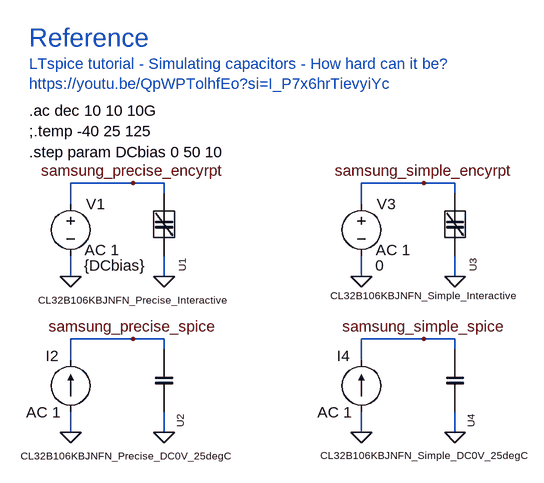
[diagram p0: schematic 07-CL32B106KBJNFN_impedance.asc]
07-CL32B106KBJNFN_impedance.asc, the LTspice schematic file:
Version 4
SHEET 1 1452 1420
WIRE 128 304 32 304
WIRE 176 304 128 304
WIRE 576 304 480 304
WIRE 624 304 576 304
WIRE 176 320 176 304
WIRE 624 320 624 304
WIRE 32 336 32 304
WIRE 480 336 480 304
WIRE 32 448 32 416
WIRE 176 448 176 416
WIRE 480 448 480 416
WIRE 624 448 624 416
WIRE 128 544 32 544
WIRE 176 544 128 544
WIRE 576 544 480 544
WIRE 624 544 576 544
WIRE 176 560 176 544
WIRE 624 560 624 544
WIRE 32 576 32 544
WIRE 480 576 480 544
WIRE 32 688 32 656
WIRE 176 688 176 656
WIRE 480 688 480 656
WIRE 624 688 624 656
FLAG 32 448 0
FLAG 176 448 0
FLAG 128 304 samsung_precise_encyrpt
FLAG 32 688 0
FLAG 176 688 0
FLAG 128 544 samsung_precise_spice
FLAG 480 448 0
FLAG 624 448 0
FLAG 576 304 samsung_simple_encyrpt
FLAG 480 688 0
FLAG 624 688 0
FLAG 576 544 samsung_simple_spice
SYMBOL CL32B106KBJNFN_Precise_Interactive_LT 176 368 R90
WINDOW 38 116 52 VCenter 1
SYMATTR InstName U1
SYMBOL current 32 656 R180
WINDOW 0 18 86 Left 2
WINDOW 3 24 0 Left 2
WINDOW 123 15 -1 Left 2
WINDOW 39 0 0 Left 0
SYMATTR InstName I2
SYMATTR Value ""
SYMATTR Value2 AC 1
SYMBOL CL32B106KBJNFN_Precise_DC0V_25degC_LT 176 608 R90
WINDOW 38 116 62 VCenter 1
SYMATTR InstName U2
SYMBOL current 480 656 R180
WINDOW 0 18 86 Left 2
WINDOW 3 24 0 Left 2
WINDOW 123 15 -1 Left 2
WINDOW 39 0 0 Left 0
SYMATTR InstName I4
SYMATTR Value ""
SYMATTR Value2 AC 1
SYMBOL CL32B106KBJNFN_Simple_Interactive_LT 624 368 R90
WINDOW 38 109 52 VCenter 1
SYMATTR InstName U3
SYMBOL CL32B106KBJNFN_Simple_DC0V_25degC_LT 624 608 R90
WINDOW 38 115 51 VCenter 1
SYMATTR InstName U4
SYMBOL voltage 480 320 R0
WINDOW 3 21 111 Left 2
WINDOW 123 22 87 Left 2
WINDOW 39 0 0 Left 0
SYMATTR InstName V3
SYMATTR Value 0
SYMATTR Value2 AC 1
SYMBOL voltage 32 320 R0
WINDOW 3 21 111 Left 2
WINDOW 123 22 87 Left 2
WINDOW 39 0 0 Left 0
SYMATTR InstName V1
SYMATTR Value {DCbias}
SYMATTR Value2 AC 1
TEXT -32 192 Left 2 !.ac dec 10 10 10G
TEXT -32 120 Left 2 ;LTspice tutorial - Simulating capacitors - How hard can it be?\nhttps://youtu.be/QpWPTolhfEo?si=I_P7x6hrTievyiYc
TEXT -32 80 Left 4 ;Reference
TEXT -32 224 Left 2 !;.temp -40 25 125
TEXT -32 256 Left 2 !.step param DCbias 0 50 10

The netlist it stands for:
* 07-CL32B106KBJNFN_impedance.asc
XU1 0 samsung_precise_encyrpt CL32B106KBJNFN_Precise_Interactive  ; pins A B
I2 0 samsung_precise_spice AC 1
XU2 0 samsung_precise_spice CL32B106KBJNFN_Precise_DC0V_25degC  ; pins A B
I4 0 samsung_simple_spice AC 1
XU3 0 samsung_simple_encyrpt CL32B106KBJNFN_Simple_Interactive  ; pins A B
XU4 0 samsung_simple_spice CL32B106KBJNFN_Simple_DC0V_25degC  ; pins A B
V3 samsung_simple_encyrpt 0 0 AC 1
V1 samsung_precise_encyrpt 0 {DCbias} AC 1
.ac dec 10 10 10G
* LTspice tutorial - Simulating capacitors - How hard can it be?
* https://youtu.be/QpWPTolhfEo?si=I_P7x6hrTievyiYc
* Reference
;.temp -40 25 125
.step param DCbias 0 50 10
.lib CL32B106KBJNFN_Precise_Interactive_LT.mod
.lib CL32B106KBJNFN_Precise_DC0V_25degC_LT.mod
.lib CL32B106KBJNFN_Simple_Interactive_LT.mod
.lib CL32B106KBJNFN_Simple_DC0V_25degC_LT.mod
.backanno
.end

* Results of the author's LTspice run, read from the files saved beside the schematic
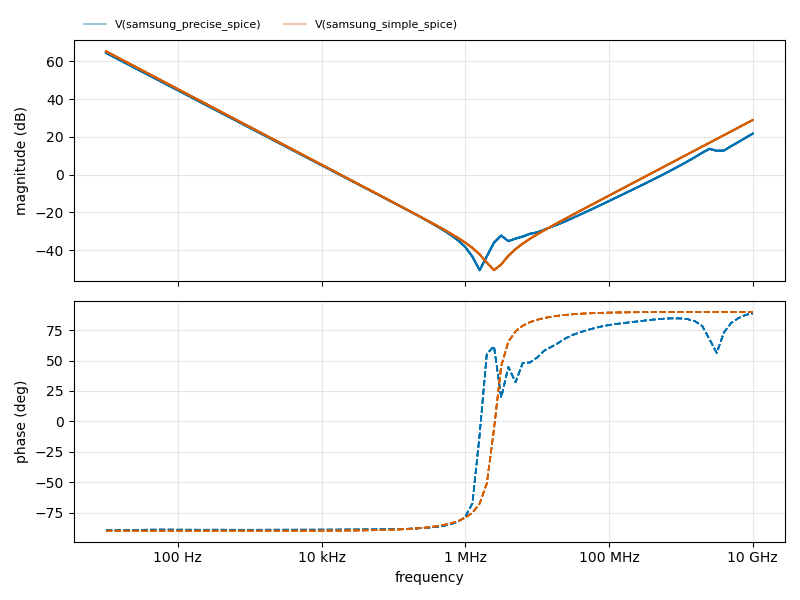
[diagram p1: AC Analysis of 07-CL32B106KBJNFN_impedance.asc, plotted from the saved traces]
* AC Analysis, 6 runs:
*   V(samsung_precise_spice) [dcbias=0]: 64.50 dB at 10 Hz, 21.73 dB at 10 GHz, peak 64.50 dB at 10 Hz, 3 dB below the peak at 14.16 Hz
*   V(samsung_precise_spice) [dcbias=10]: 64.50 dB at 10 Hz, 21.73 dB at 10 GHz, peak 64.50 dB at 10 Hz, 3 dB below the peak at 14.16 Hz
*   V(samsung_precise_spice) [dcbias=20]: 64.50 dB at 10 Hz, 21.73 dB at 10 GHz, peak 64.50 dB at 10 Hz, 3 dB below the peak at 14.16 Hz
*   V(samsung_precise_spice) [dcbias=30]: 64.50 dB at 10 Hz, 21.73 dB at 10 GHz, peak 64.50 dB at 10 Hz, 3 dB below the peak at 14.16 Hz
*   V(samsung_precise_spice) [dcbias=40]: 64.50 dB at 10 Hz, 21.73 dB at 10 GHz, peak 64.50 dB at 10 Hz, 3 dB below the peak at 14.16 Hz
*   V(samsung_precise_spice) [dcbias=50]: 64.50 dB at 10 Hz, 21.73 dB at 10 GHz, peak 64.50 dB at 10 Hz, 3 dB below the peak at 14.16 Hz
*   V(samsung_simple_spice) [dcbias=0]: 65.33 dB at 10 Hz, 28.93 dB at 10 GHz, peak 65.33 dB at 10 Hz, 3 dB below the peak at 14.14 Hz
*   V(samsung_simple_spice) [dcbias=10]: 65.33 dB at 10 Hz, 28.93 dB at 10 GHz, peak 65.33 dB at 10 Hz, 3 dB below the peak at 14.14 Hz
*   V(samsung_simple_spice) [dcbias=20]: 65.33 dB at 10 Hz, 28.93 dB at 10 GHz, peak 65.33 dB at 10 Hz, 3 dB below the peak at 14.14 Hz
*   V(samsung_simple_spice) [dcbias=30]: 65.33 dB at 10 Hz, 28.93 dB at 10 GHz, peak 65.33 dB at 10 Hz, 3 dB below the peak at 14.14 Hz
*   V(samsung_simple_spice) [dcbias=40]: 65.33 dB at 10 Hz, 28.93 dB at 10 GHz, peak 65.33 dB at 10 Hz, 3 dB below the peak at 14.14 Hz
*   V(samsung_simple_spice) [dcbias=50]: 65.33 dB at 10 Hz, 28.93 dB at 10 GHz, peak 65.33 dB at 10 Hz, 3 dB below the peak at 14.14 Hz